# EAGLE design 2k6-0005 (EAGLE 6.6.0)
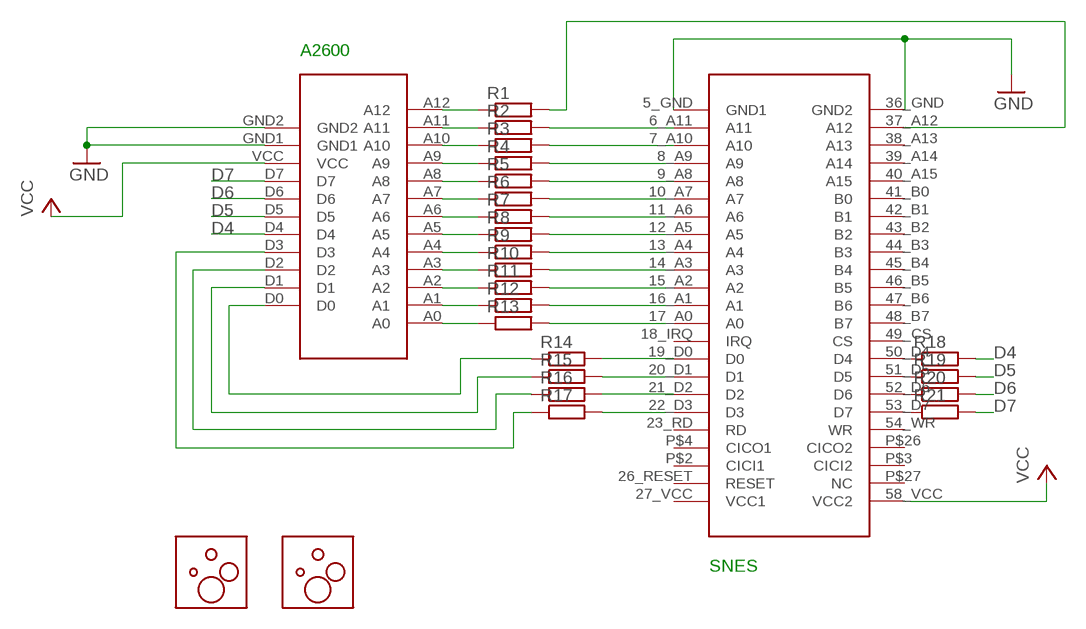
[diagram p0: schematic, sheet 1]

## Parts
R1  R-EU_R0402  [R0402]
R2  R-EU_R0402  [R0402]
R3  R-EU_R0402  [R0402]
R4  R-EU_R0402  [R0402]
R5  R-EU_R0402  [R0402]
R6  R-EU_R0402  [R0402]
R7  R-EU_R0402  [R0402]
R8  R-EU_R0402  [R0402]
R9  R-EU_R0402  [R0402]
R10  R-EU_R0402  [R0402]
R11  R-EU_R0402  [R0402]
R12  R-EU_R0402  [R0402]
R13  R-EU_R0402  [R0402]
R14  R-EU_R0402  [R0402]
R15  R-EU_R0402  [R0402]
R16  R-EU_R0402  [R0402]
R17  R-EU_R0402  [R0402]
R18  R-EU_R0402  [R0402]
R19  R-EU_R0402  [R0402]
R20  R-EU_R0402  [R0402]
R21  R-EU_R0402  [R0402]
U$1  2600CARTBIGGERPADS  [2600EDGE-BIGGER]
U$2  SNESCART  [SNESEDGE]
U$3  STENCIL-ALIGN  [STENCIL-ALIGN]
U$4  STENCIL-ALIGN  [STENCIL-ALIGN]

## Nets
D4: R18.2 U$1.D4
D5: R19.2 U$1.D5
D6: R20.2 U$1.D6
D7: R21.2 U$1.D7
GND: U$1.GND1 U$1.GND2 U$2.5_GND(GND1) U$2.36_GND(GND2)
N$1: R13.2 U$2.17_A0(A0)
N$2: R12.2 U$2.16_A1(A1)
N$3: R11.2 U$2.15_A2(A2)
N$4: R10.2 U$2.14_A3(A3)
N$5: R9.2 U$2.13_A4(A4)
N$6: R8.2 U$2.12_A5(A5)
N$7: R7.2 U$2.11_A6(A6)
N$8: R6.2 U$2.10_A7(A7)
N$9: R5.2 U$2.9_A8(A8)
N$10: R4.2 U$2.8_A9(A9)
N$11: R3.2 U$2.7_A10(A10)
N$12: R2.2 U$2.6_A11(A11)
N$13: R14.1 U$1.D0
N$14: R15.1 U$1.D1
N$15: R16.1 U$1.D2
N$16: R17.1 U$1.D3
N$17: R1.2 U$2.37_A12(A12)
N$19: R1.1 U$1.A12
N$20: R2.1 U$1.A11
N$21: R3.1 U$1.A10
N$22: R4.1 U$1.A9
N$23: R5.1 U$1.A8
N$24: R6.1 U$1.A7
N$25: R7.1 U$1.A6
N$26: R8.1 U$1.A5
N$27: R9.1 U$1.A4
N$28: R10.1 U$1.A3
N$29: R11.1 U$1.A2
N$30: R12.1 U$1.A1
N$31: R13.1 U$1.A0
N$32: R14.2 U$2.19_D0(D0)
N$33: R16.2 U$2.21_D2(D2)
N$34: R15.2 U$2.20_D1(D1)
N$35: R17.2 U$2.22_D3(D3)
N$36: R18.1 U$2.50_D4(D4)
N$37: R19.1 U$2.51_D5(D5)
N$38: R20.1 U$2.52_D6(D6)
N$39: R21.1 U$2.53_D7(D7)
VCC: U$1.VCC U$2.58_VCC(VCC2)
Unconnected: U$2.18_IRQ(IRQ) U$2.23_RD(RD) U$2.26_RESET(RESET) U$2.27_VCC(VCC1) U$2.38_A13(A13) U$2.39_A14(A14) U$2.40_A15(A15) U$2.41_B0(B0) U$2.42_B1(B1) U$2.43_B2(B2) U$2.44_B3(B3) U$2.45_B4(B4) U$2.46_B5(B5) U$2.47_B6(B6) U$2.48_B7(B7) U$2.49_CS(CS) U$2.54_WR(WR) U$2.P$2(CICI1) U$2.P$3(CICI2) U$2.P$4(CICO1) U$2.P$26(CICO2) U$2.P$27(NC)

## Notes on the sheet
- A2600
- SNES

## Library data of the parts
R1-R21 = rcl:R-EU_: RESISTOR, European symbol
U$1 = snes-2600:2600CART
U$2 = snescart-male:SNESCART
U$3 U$4 = connectorsAndICs5:STENCIL-ALIGN

## Board
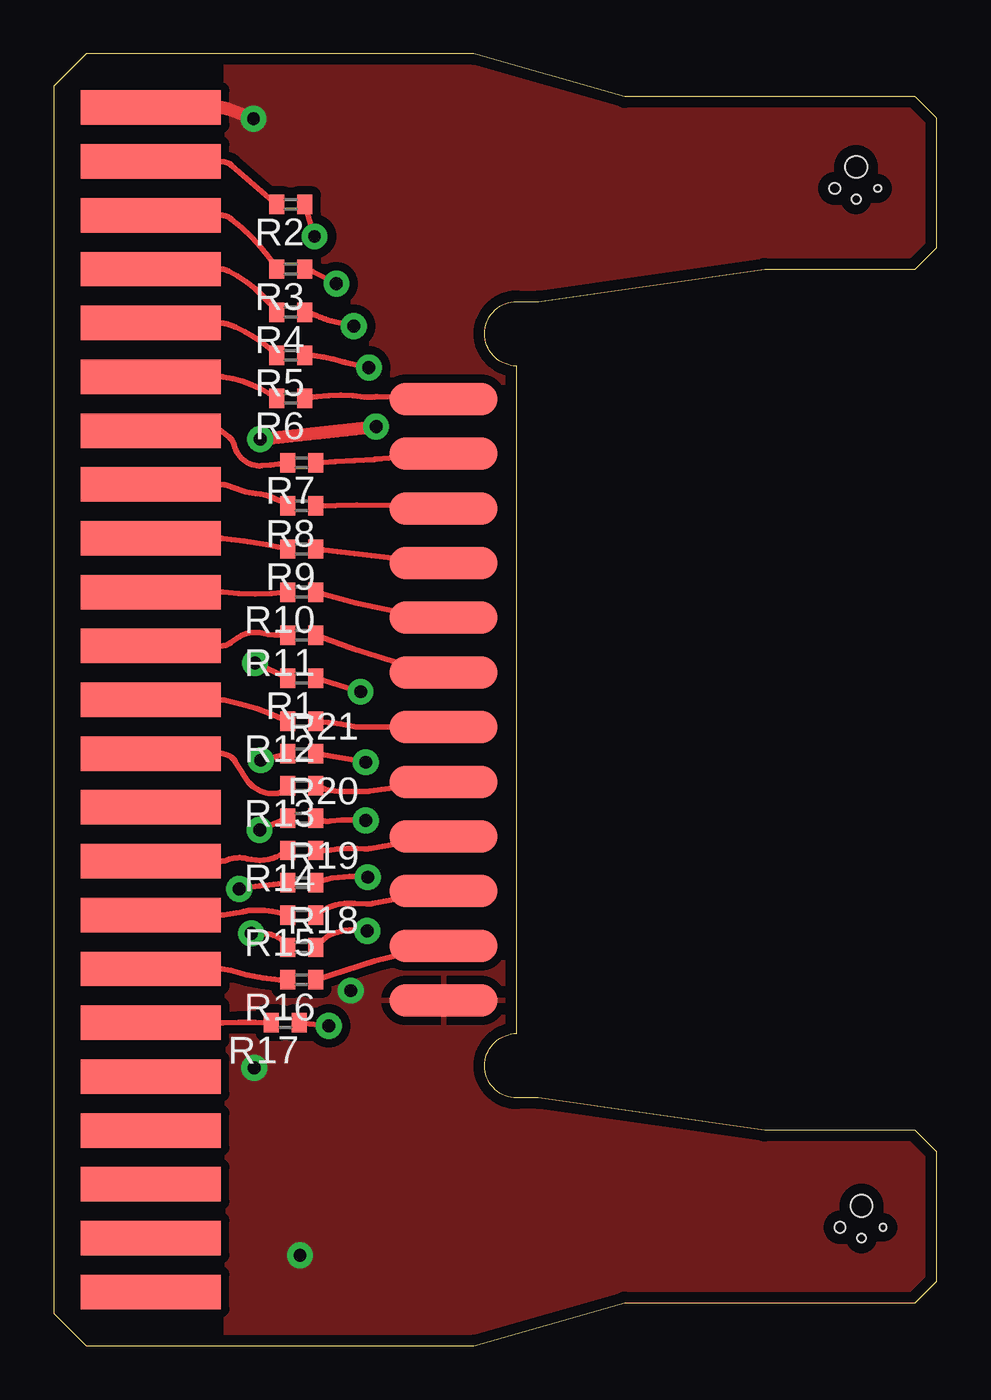
[diagram p1: board, top side]
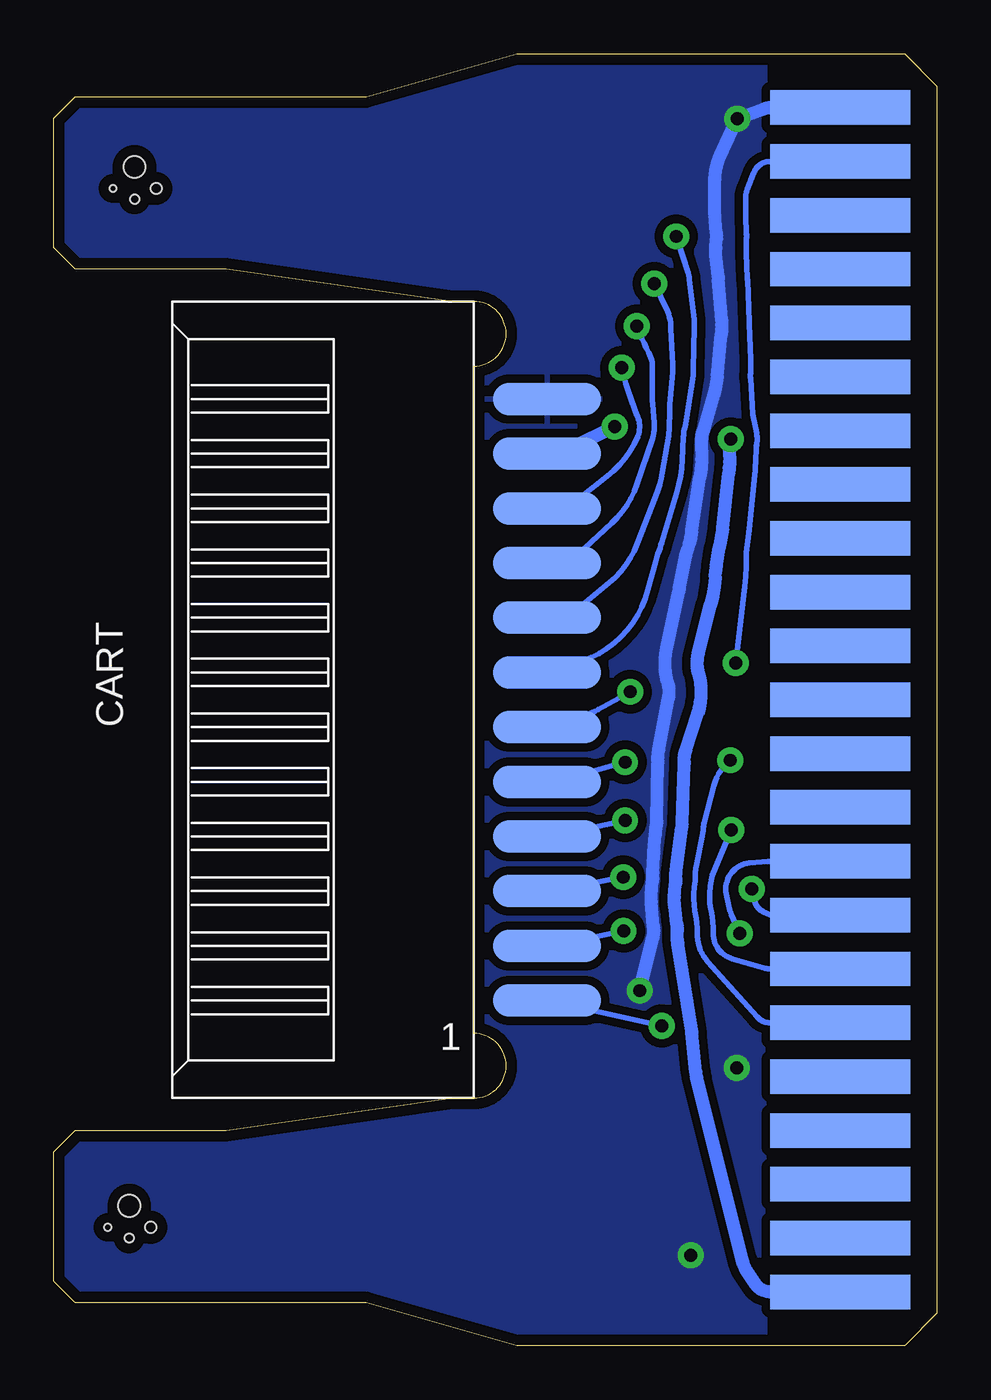
[diagram p2: board, bottom side, seen from below]

Size 41 x 60 mm. Coordinates in mm from the lower left corner, seen from the top.
Outline: 0,1.5 1.5,0 19.5,0 26.5,2 40,2 41,3 41,9 40,10 33,10 22.5,11.5 21.5,11.5 arc-90 20,13 arc-90 21.5,14.5 21.5,45.5 arc-90 20,47 arc-90 21.5,48.5 22.5,48.5 33,50 40,50 41,51 41,57 40,58 26.5,58 19.5,60 1.5,60 0,58.5 0,1.5
Copper layers (1*16): Top 0.035mm / dielectric 1.1mm / Bottom 0.035mm
Design rules "default": minimum track width 8mil, minimum drill 12mil, track to track 8mil, track to pad 8mil, pad to pad 8mil, via to via 8mil, smd to smd 8mil, copper to edge 20mil, drill to drill 8mil, minimum pad ring 0.3mm, minimum via ring 0.3mm, stop-mask expansion 3mil, vias tented up to drill 40mil, thermal gap 0.4mm

### Footprints (pad centres in the part's own frame; a part is rotated, then mirrored left to right if it is on the bottom)
R0402 = smd 0.7 x 0.9: 1 -0.65,0; 2 0.65,0
2600EDGE-BIGGER = smd 5 x 1.5 bottom: A0 1.905,-3.81; A1 1.905,-1.27; A2 1.905,1.27; A3 1.905,3.81; A4 1.905,6.35; A5 1.905,8.89; A6 1.905,11.43; A7 1.905,13.97; D0 1.905,-6.35; D1 1.905,-8.89; D2 1.905,-11.43; GND2 1.905,-13.97 | smd 5 x 1.5: A8 1.905,8.89; A9 1.905,6.35; A10 1.905,3.81; A11 1.905,1.27; A12 1.905,-1.27; D3 1.905,-13.97; D4 1.905,-11.43; D5 1.905,-8.89; D6 1.905,-6.35; D7 1.905,-3.81; GND1 1.905,13.97; VCC 1.905,11.43
SNESEDGE = smd 6.5 x 1.6: 5_GND 0.5,27.5; 6_A11 0.5,25; 7_A10 0.5,22.5; 8_A9 0.5,20; 9_A8 0.5,17.5; 10_A7 0.5,15; 11_A6 0.5,12.5; 12_A5 0.5,10; 13_A4 0.5,7.5; 14_A3 0.5,5; 15_A2 0.5,2.5; 16_A1 0.5,0; 17_A0 0.5,-2.5; 18_IRQ 0.5,-5; 19_D0 0.5,-7.5; 20_D1 0.5,-10; 21_D2 0.5,-12.5; 22_D3 0.5,-15; 23_RD 0.5,-17.5; 26_RESET 0.5,-25; 27_VCC 0.5,-27.5; P$26 0.5,-22.5; P$27 0.5,-20 | smd 6.5 x 1.6 bottom: 36_GND 0.5,27.5; 37_A12 0.5,25; 38_A13 0.5,22.5; 39_A14 0.5,20; 40_A15 0.5,17.5; 41_B0 0.5,15; 42_B1 0.5,12.5; 43_B2 0.5,10; 44_B3 0.5,7.5; 45_B4 0.5,5; 46_B5 0.5,2.5; 47_B6 0.5,0; 48_B7 0.5,-2.5; 49_CS 0.5,-5; 50_D4 0.5,-7.5; 51_D5 0.5,-10; 52_D6 0.5,-12.5; 53_D7 0.5,-15; 54_WR 0.5,-17.5; 58_VCC 0.5,-27.5; P$2 0.5,-25; P$3 0.5,-22.5; P$4 0.5,-20
STENCIL-ALIGN = hole 0.3: 1,0 | hole 0.4: 0,-0.5 | hole 0.5: -1,0 | hole 1: 0,1

### Placement (x,y rotation side)
R1  11.5,31 180 top
R2  11,53 180 top
R3  11,50 180 top
R4  11,48 180 top
R5  11,46 180 top
R6  11,44 180 top
R7  11.5,41 180 top
R8  11.5,39 180 top
R9  11.5,37 180 top
R10  11.5,35 180 top
R11  11.5,33 180 top
R12  11.5,29 180 top
R13  11.5,26 180 top
R14  11.5,23 180 top
R15  11.5,20 180 top
R16  11.5,17 180 top
R17  10.75,15 180 top
R18  11.5,18.5 0 top
R19  11.5,21.5 0 top
R20  11.5,24.5 0 top
R21  11.5,27.5 0 top
U$1  20,30 0 bottom
U$2  4,30 0 top
U$3  37.5,5.5 0 top
U$4  37.25,53.75 0 top

### Tracks (layer width: path | path; a pad name or v marks a point on that pad's centre or on a via)
D4  (via drill 0.6)
  Top 0.254: v14.55,19.27 13.91,19.3 arc5 13.67,19.3 arc50 R18.2
  Bottom 0.254: v14.55,19.27 17.56,18.63 arc12 U$1.D4
D5  (via drill 0.6)
  Top 0.254: v14.57,21.76 14.02,21.78 arc9 13.21,21.76 arc15 R19.2
  Bottom 0.254: v14.57,21.76 17.6,21.16 arc11 U$1.D5
D6  (via drill 0.6)
  Top 0.254: v14.48,24.39 arc12 12.83,24.36 arc-37 R20.2
  Bottom 0.254: v14.48,24.39 17.55,23.71 arc13 U$1.D6
D7  (via drill 0.6)
  Top 0.254: v14.48,27.1 R21.2
  Bottom 0.254: v14.48,27.1 17.41,26.28 arc16 U$1.D7
GND  (via drill 0.6)
  Top 0.6: v9.27,56.99 8.03,57.45 arc20 7.75,57.5 U$2.36_GND
  Bottom 0.6: U$2.36_GND 7.75,57.5 arc-20 8.03,57.45 v9.27,56.99 10.07,55.28 arc-25 10.3,54.2 10.3,52.5 arc-5 10.29,52.27 10.24,51.69 arc9 10.24,51.38 10.27,50.98 arc-11 10.26,50.49 10.16,49.68 arc3 10.14,49.54 10,47.64 arc10 10.01,46.97 10.2,45 arc11 10.36,44.17 10.86,42.48 arc-15 10.91,42.13 10.92,41.77 arc-3 10.92,41.62 10.92,41.6 arc10 11,40.33 11.39,37.85 arc8 11.59,36.96 11.59,36.94 arc-6 11.69,36.56 11.96,35.16 arc1 11.98,35.03 12.55,32.39 arc-27 12.51,30.84 arc26 12.48,30.05 12.91,27.69 arc-11 12.96,27.14 12.96,27.12 arc2 12.96,27.07 13.01,24.36 arc8 13.03,24.15 arc-5 13.08,23.73 13.14,22.93 arc-2 13.15,22.77 13.19,21.97 arc-2 13.2,21.75 | v13.79,16.49 13.19,18.94 arc-20 13.16,19.42 arc1 13.17,19.5 13.24,20.3 arc13 13.21,21.55 13.21,21.57 arc-7 13.2,21.75 | 13.2,21.75
  other vias: 11.43,4.19 9.3,12.9
  pour Top (isolate 0.4): 8,60 41,60 41,0 8,0
  pour Bottom (isolate 0.4): 8,60 41,60 41,0 8,0
N$1
  Top 0.254: U$2.17_A0 7.75,27.5 arc-59 8.43,27.12 8.88,26.38 arc60 10.26,25.64 arc60 R13.2
N$2
  Top 0.254: U$2.16_A1 7.75,30 arc-11 7.91,29.98 arc-14 R12.2
N$3
  Top 0.254: U$2.15_A2 7.75,32.5 arc36 8.22,32.65 8.5,32.86 arc-48 9.65,33.09 arc16 R11.2
N$4
  Top 0.254: U$2.14_A3 7.75,35 arc-7 7.84,34.99 arc14 R10.2
N$5
  Top 0.254: U$2.13_A4 7.75,37.5 arc-7 7.84,37.49 arc-6 R9.2
N$6
  Top 0.254: U$2.12_A5 7.75,40 arc-18 8,39.96 8.79,39.7 arc14 9.38,39.58 arc-34 R8.2
N$7
  Top 0.254: U$2.11_A6 7.75,42.5 8.14,42.21 arc-40 8.37,41.84 8.37,41.83 arc81 9.65,40.87 arc6 R7.2
N$8
  Top 0.254: U$2.10_A7 7.75,45 arc-8 7.86,44.99 arc-27 R6.2
N$9
  Top 0.254: U$2.9_A8 7.75,47.5 arc-18 8,47.46 arc-28 R5.2
N$10
  Top 0.254: U$2.8_A9 7.75,50 arc-27 8.11,49.91 arc-27 R4.2
N$11
  Top 0.254: U$2.7_A10 7.75,52.5 arc-38 8.24,52.33 arc-20 R3.2
N$12
  Top 0.254: U$2.6_A11 7.75,55 arc-41 8.27,54.81 arc-1 R2.2
N$13
  Top 0.254: U$1.D0 arc10 17.66,23.61 14.71,23.09 arc-12 14.42,23.07 14.07,23.09 arc12 12.73,23.01 arc-16 R14.1
N$14
  Top 0.254: U$1.D1 arc11 17.63,21.07 14.8,20.54 arc-13 14.52,20.52 13.96,20.54 arc7 13.5,20.53 arc35 R15.1
N$15
  Top 0.254: U$1.D2 arc14 17.5,18.5 14.89,17.87 R16.1
N$16  (via drill 0.6)
  Top 0.254: v12.77,14.85 R17.1
  Bottom 0.254: v12.77,14.85 U$1.D3
N$17  (via drill 0.6)
  Top 0.254: v9.34,31.7 R1.2
  Bottom 0.254: v9.34,31.7 8.92,35.26 arc-9 8.86,36.65 8.86,36.66 arc9 8.85,36.84 8.74,37.72 arc-1 8.72,37.92 8.46,40.44 arc-4 8.41,41.04 8.39,41.73 arc10 8.37,41.83 8.37,41.84 arc-24 8.37,42.36 8.37,42.37 8.37,42.38 8.53,43.14 arc8 8.54,43.25 8.65,44.94 arc6 8.66,45.03 8.65,45.23 arc-5 8.65,45.73 8.65,45.76 arc1 8.65,45.77 8.72,47.46 arc1 8.72,47.47 8.72,47.49 arc-1 8.72,47.54 8.79,49.48 arc-1 8.8,49.55 8.86,50.74 arc5 8.86,50.84 8.84,51.41 arc-4 8.84,51.66 8.88,52.45 arc2 8.88,52.5 8.88,53.3 arc21 8.8,53.71 8.49,54.49 arc69 7.75,55 U$2.37_A12
N$18
  cutout Bottom: 15,43.5 15.4,43.6 15.4,44.6 15,44.6 14.8,43.6
N$19  (via drill 0.6)
  Top 0.254: v14.24,30.37 R1.1
  Bottom 0.254: v14.24,30.37 15.72,29.55 arc6 16.2,29.31 17.11,28.93 arc23 U$1.A12
N$20  (via drill 0.6)
  Top 0.254: R2.1 v12.1,51.52
  Bottom 0.254: v12.1,51.52 11.56,49.82 arc11 11.49,49.51 11.28,47.65 arc8 11.26,47.29 11.3,45.36 arc8 11.34,44.92 11.65,42.96 arc3 11.72,42.58 11.72,42.57 arc-10 11.77,42.2 11.82,41.14 arc14 12.08,39.63 12.77,37.3 arc4 12.9,36.94 | 12.9,36.94 | 12.9,36.94 arc-6 13.06,36.42 13.42,35.09 arc50 16.06,31.96 17.03,31.51 arc25 U$1.A11
N$21  (via drill 0.6)
  Top 0.254: v13.12,49.32 12.02,49.89 arc-18 11.54,50.16 R3.1
  Bottom 0.254: v13.12,49.32 12.51,48.02 arc24 12.36,47.39 12.36,47.38 arc-2 12.35,47.24 12.26,45.56 arc8 12.26,45.23 12.39,43.7 arc-4 12.41,43.4 12.43,42.63 arc8 12.46,42.28 12.75,40.55 arc12 13.05,39.45 13.91,37.25 arc29 15.22,35.43 16.47,34.4 arc40 U$1.A10
N$22  (via drill 0.6)
  Top 0.254: v13.93,47.35 12.72,47.64 arc-13 12.34,47.78 arc18 R4.1
  Bottom 0.254: v13.93,47.35 13.69,46.77 arc-6 13.38,46.12 13.38,46.11 arc29 13.21,45.42 13.22,44.25 arc-5 13.2,43.73 13.12,42.85 arc24 13.21,42.09 13.93,40.01 arc28 15.11,38.2 16.37,37.02 arc43 U$1.A9
N$23  (via drill 0.6)
  Top 0.254: v14.63,45.43 13.56,45.66 arc-6 13.4,45.71 arc17 R5.1
  Bottom 0.254: v14.63,45.43 14.63,45.41 arc-9 14.34,44.34 14.05,43.54 arc-3 13.9,43.17 13.89,43.15 arc46 13.89,42.25 13.89,42.23 arc30 15.31,40.38 16.54,39.42 arc38 U$1.A8
N$24
  Top 0.254: U$1.A7 15,44.07 arc9 14.8,44.06 14.79,44.06 arc-15 14.44,44.06 arc19 R6.1
N$25
  Top 0.254: U$1.A6 arc5 17.88,41.42 15,41.17 arc-2 14.87,41.16 arc0 R7.1
N$26
  Top 0.254: U$1.A5 arc-5 17.89,38.9 arc7 R8.1
N$27
  Top 0.254: U$1.A4 arc-7 17.52,36.38 R9.1
N$28
  Top 0.254: U$1.A3 arc-7 17.8,33.83 arc-10 R10.1
N$29
  Top 0.254: U$1.A2 arc-13 17.54,31.33 arc-9 R11.1
N$30
  Top 0.254: U$1.A1 14.48,28.74 arc4 14.36,28.73 arc-16 13.91,28.76 arc8 R12.1
N$31
  Top 0.254: U$1.A0 arc8 17.76,26.17 14.66,25.76 arc-8 14.48,25.75 14.47,25.75 13.74,25.74 arc1 13.51,25.74 arc-26 R13.1
N$32
  Top 0.254: U$2.19_D0 7.75,22.5 arc22 8.05,22.56 | 8.05,22.56 | 8.05,22.56 arc-37 8.97,22.62 arc53 R14.2
N$33
  Top 0.254: U$2.21_D2 7.75,17.5 arc-3 7.79,17.5 8.2,17.42 arc11 10.46,16.98 R16.2
N$34
  Top 0.254: U$2.20_D1 7.75,20 arc9 7.88,20.01 8.77,20.16 arc6 8.88,20.18 | 8.88,20.18 | 8.88,20.18 arc-11 9.08,20.21 arc-22 R15.2
N$35
  Top 0.254: U$2.22_D3 7.75,15 arc-7 7.84,14.99 arc-5 R17.2
N$36  (via drill 0.6)
  Top 0.254: v9.16,19.14 | v9.16,19.14 arc7 9.76,19.13 arc-65 R18.1
  Bottom 0.254: U$2.50_D4 7.75,22.5 arc-5 7.82,22.5 8.71,22.41 arc-96 9.78,20.99 9.67,20.42 arc-12 9.54,20.03 v9.16,19.14
N$37  (via drill 0.6)
  Top 0.254: v8.6,21.22 | v8.6,21.22 arc-9 8.92,21.28 arc0 R19.1
  Bottom 0.254: U$2.51_D5 7.75,20 8.06,20.15 arc50 8.45,20.62 v8.6,21.22
N$38  (via drill 0.6)
  Top 0.254: v9.55,23.96 R20.1
  Bottom 0.254: U$2.52_D6 7.75,17.5 arc16 7.97,17.53 9.49,17.96 arc76 10.38,19.17 | 10.38,19.17 | 10.38,19.17 arc-14 10.48,20.18 arc17 10.54,20.99 10.52,21.35 arc19 10.38,21.96 v9.55,23.96
N$39  (via drill 0.6)
  Top 0.254: v9.6,27.19 R21.1
  Bottom 0.254: U$2.53_D7 7.75,15 arc48 8.35,15.27 10.63,17.82 arc43 11.13,19.19 arc-11 11.18,19.85 11.24,20.2 arc18 11.26,21.28 11.26,21.3 arc-7 11.23,21.73 | 11.23,21.73 | 11.23,21.73 arc11 11.16,22.38 10.9,23.68 arc-6 10.85,24.06 10.85,24.08 arc10 10.81,24.29 10.35,26 arc35 v9.6,27.19
VCC  (via drill 0.6)
  Top 0.6: v9.58,42.1 14.93,42.69 arc1 v14.96,42.69
  Bottom 0.6: v14.96,42.69 16.97,41.7 arc26 U$1.VCC | U$2.58_VCC 7.75,2.5 arc56 8.41,2.86 8.83,3.48 arc20 9.01,3.89 11.14,12.44 arc8 11.19,12.71 11.38,14.54 arc-3 11.39,14.64 12.02,18.69 arc10 12.06,19.21 | 12.06,19.21 | 12.06,19.21 arc-8 12.07,19.58 12.16,20.25 arc15 12.15,21.41 12.15,21.43 arc-7 12.13,21.74 | 12.13,21.74 | 12.13,21.74 arc7 12.09,22.27 11.86,24.04 arc-5 11.83,24.29 11.73,27 arc-3 11.73,27.14 11.73,27.16 arc19 11.66,27.66 11.11,29.37 arc-33 11.07,31.23 arc29 11.08,32.14 10.5,34.43 arc-9 10.29,35.67 10.26,36.02 arc4 10.24,36.19 10.1,37.07 arc3 10.08,37.19 | 10.08,37.19 | 10.08,37.19 arc-6 9.95,37.98 9.67,40.49 arc-6 9.62,41.32 9.62,41.72 arc7 9.6,41.95 | 9.6,41.95 | v9.58,42.1 arc2 9.6,41.95 | v9.58,42.1

### Text on the board
tStop: 21x / 100 Ohm / 0402 | COVER | RETRODE'S | TOWARDS | THIS SIDE
bStop: 2600 | Plug-in | Retrode | M. Hullin | (C) 2012 | LABEL SIDE | 2600